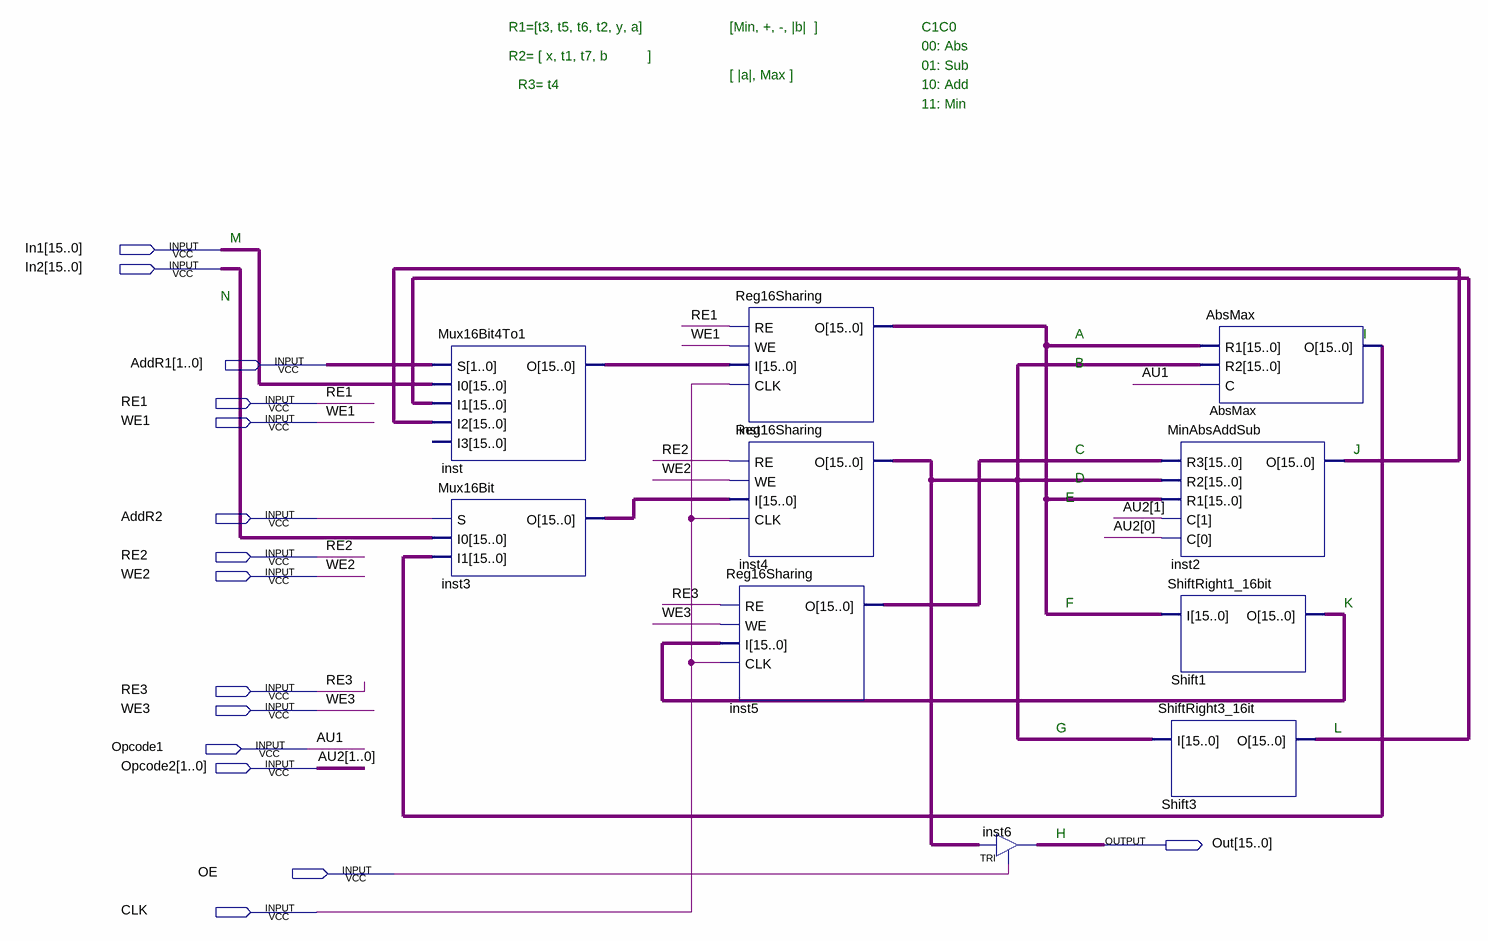
[diagram p0: schematic sheet]
// Quartus schematic FunctionUnitSharingDatapath.bdf as structural Verilog: 10 symbols, 15 pins
module FunctionUnitSharingDatapath (
  input  [15:0] In1,
  input  [15:0] In2,
  input  [1:0] AddR1,
  input  RE1,
  input  WE1,
  input  AddR2,
  input  RE2,
  input  WE2,
  input  RE3,
  input  WE3,
  input  Opcode1,
  input  [1:0] Opcode2,
  input  OE,
  input  CLK,
  output [15:0] Out
);

  wire [15:0] AbsMax_o, inst1_o, inst2_o, inst3_o, inst4_o, inst5_o, inst_o, Shift1_o, Shift3_o;

  Mux16Bit4To1 inst (.S(AddR1), .I0(In1), .I1(Shift3_o), .I2(inst2_o), .O(inst_o));  // open: I3
  Mux16Bit inst3 (.S(AddR2), .I0(In2), .I1(AbsMax_o), .O(inst3_o));
  Reg16Sharing inst1 (.RE(RE1), .WE(WE1), .I(inst_o), .CLK(CLK), .O(inst1_o));
  Reg16Sharing inst4 (.RE(RE2), .WE(WE2), .I(inst3_o), .CLK(CLK), .O(inst4_o));
  Reg16Sharing inst5 (.RE(RE3), .WE(WE3), .I(Shift1_o), .CLK(CLK), .O(inst5_o));
  TRI inst6[15:0] (.IN(inst4_o), .OE(OE), .OUT(Out));
  AbsMax AbsMax (.R1(inst1_o), .R2(inst4_o), .C(Opcode1), .O(AbsMax_o));
  MinAbsAddSub inst2 (.R3(inst5_o), .R2(inst4_o), .R1(inst1_o), .C(Opcode2), .O(inst2_o));
  ShiftRight1_16bit Shift1 (.I(inst1_o), .O(Shift1_o));
  ShiftRight3_16it Shift3 (.I(inst4_o), .O(Shift3_o));

  // Other names for the same wires on the sheet: AU1 = Opcode1; AU2[1:0] = Opcode2

  // Notes on the sheet:
  //   R1=[t3, t5, t6, t2, y, a]            
  //   [Min, +, -, |b|  ]
  //   C1C0
  //   00: Abs
  //   R2= [ x, t1, t7, b          ]
  //   01: Sub
  //   [ |a|, Max ]   
  //   R3= t4             
  //   10: Add
  //   11: Min
  //   M
  //   N
  //   A
  //   I
  //   B
  //   C
  //   J
  //   D
  //   E
  //   F
  //   K
  //   G
  //   L
  //   H
endmodule
